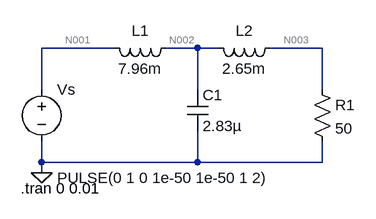
[diagram p0: schematic (2)ButLPF.asc]
(2)ButLPF.asc, the LTspice schematic file:
Version 4
SHEET 1 880 680
WIRE 112 48 0 48
WIRE 240 48 192 48
WIRE 272 48 240 48
WIRE 432 48 352 48
WIRE 0 112 0 48
WIRE 240 112 240 48
WIRE 432 112 432 48
WIRE 0 224 0 192
WIRE 240 224 240 176
WIRE 240 224 0 224
WIRE 432 224 432 192
WIRE 432 224 240 224
WIRE 0 240 0 224
FLAG 0 240 0
SYMBOL voltage 0 96 R0
WINDOW 123 24 124 Left 2
WINDOW 39 0 0 Left 2
WINDOW 3 24 152 Left 2
SYMATTR InstName Vs
SYMATTR Value PULSE(0 1 0 1e-50 1e-50 1 2)
SYMBOL ind 208 32 R90
WINDOW 0 5 56 VBottom 2
WINDOW 3 32 56 VTop 2
SYMATTR InstName L1
SYMATTR Value 7.96m
SYMBOL ind 368 32 R90
WINDOW 0 5 56 VBottom 2
WINDOW 3 32 56 VTop 2
SYMATTR InstName L2
SYMATTR Value 2.65m
SYMBOL res 416 96 R0
SYMATTR InstName R1
SYMATTR Value 50
SYMBOL cap 224 112 R0
SYMATTR InstName C1
SYMATTR Value 2.83µ
TEXT -32 264 Left 2 !.tran 0 0.01

The netlist it stands for:
* (2)ButLPF.asc
Vs N001 0 PULSE(0 1 0 1e-50 1e-50 1 2)
L1 N002 N001 7.96m
L2 N003 N002 2.65m
R1 N003 0 50
C1 N002 0 2.83µ
.tran 0 0.01
.backanno
.end

* Results of the author's LTspice run, read from the files saved beside the schematic
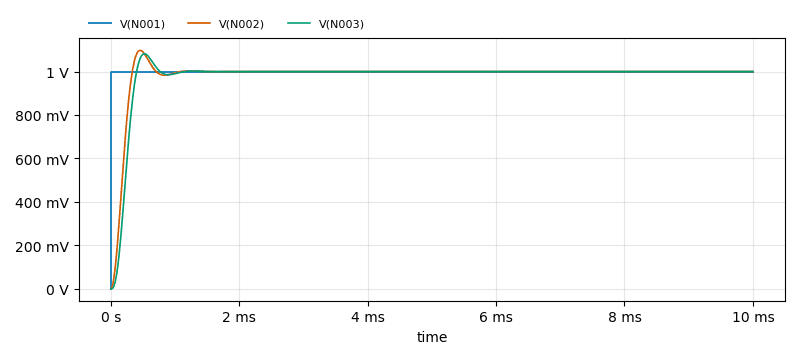
[diagram p1: Transient Analysis of (2)ButLPF.asc, plotted from the saved traces]
* Transient Analysis, 1 run:
*   V(N001): min 0 V, max 1 V, average 1 V, rms 1 V, last 1 V
*   V(N002): min 0 V, max 1.097 V, average 984 mV, rms 990.6 mV, last 1 V
*   V(N003): min 0 V, max 1.082 V, average 978.7 mV, rms 987.5 mV, last 1 V